# EAGLE design femtoBeacon_r2.0.7_RGB_OTG (EAGLE 7.6.0)

## Sheet 1 of 2
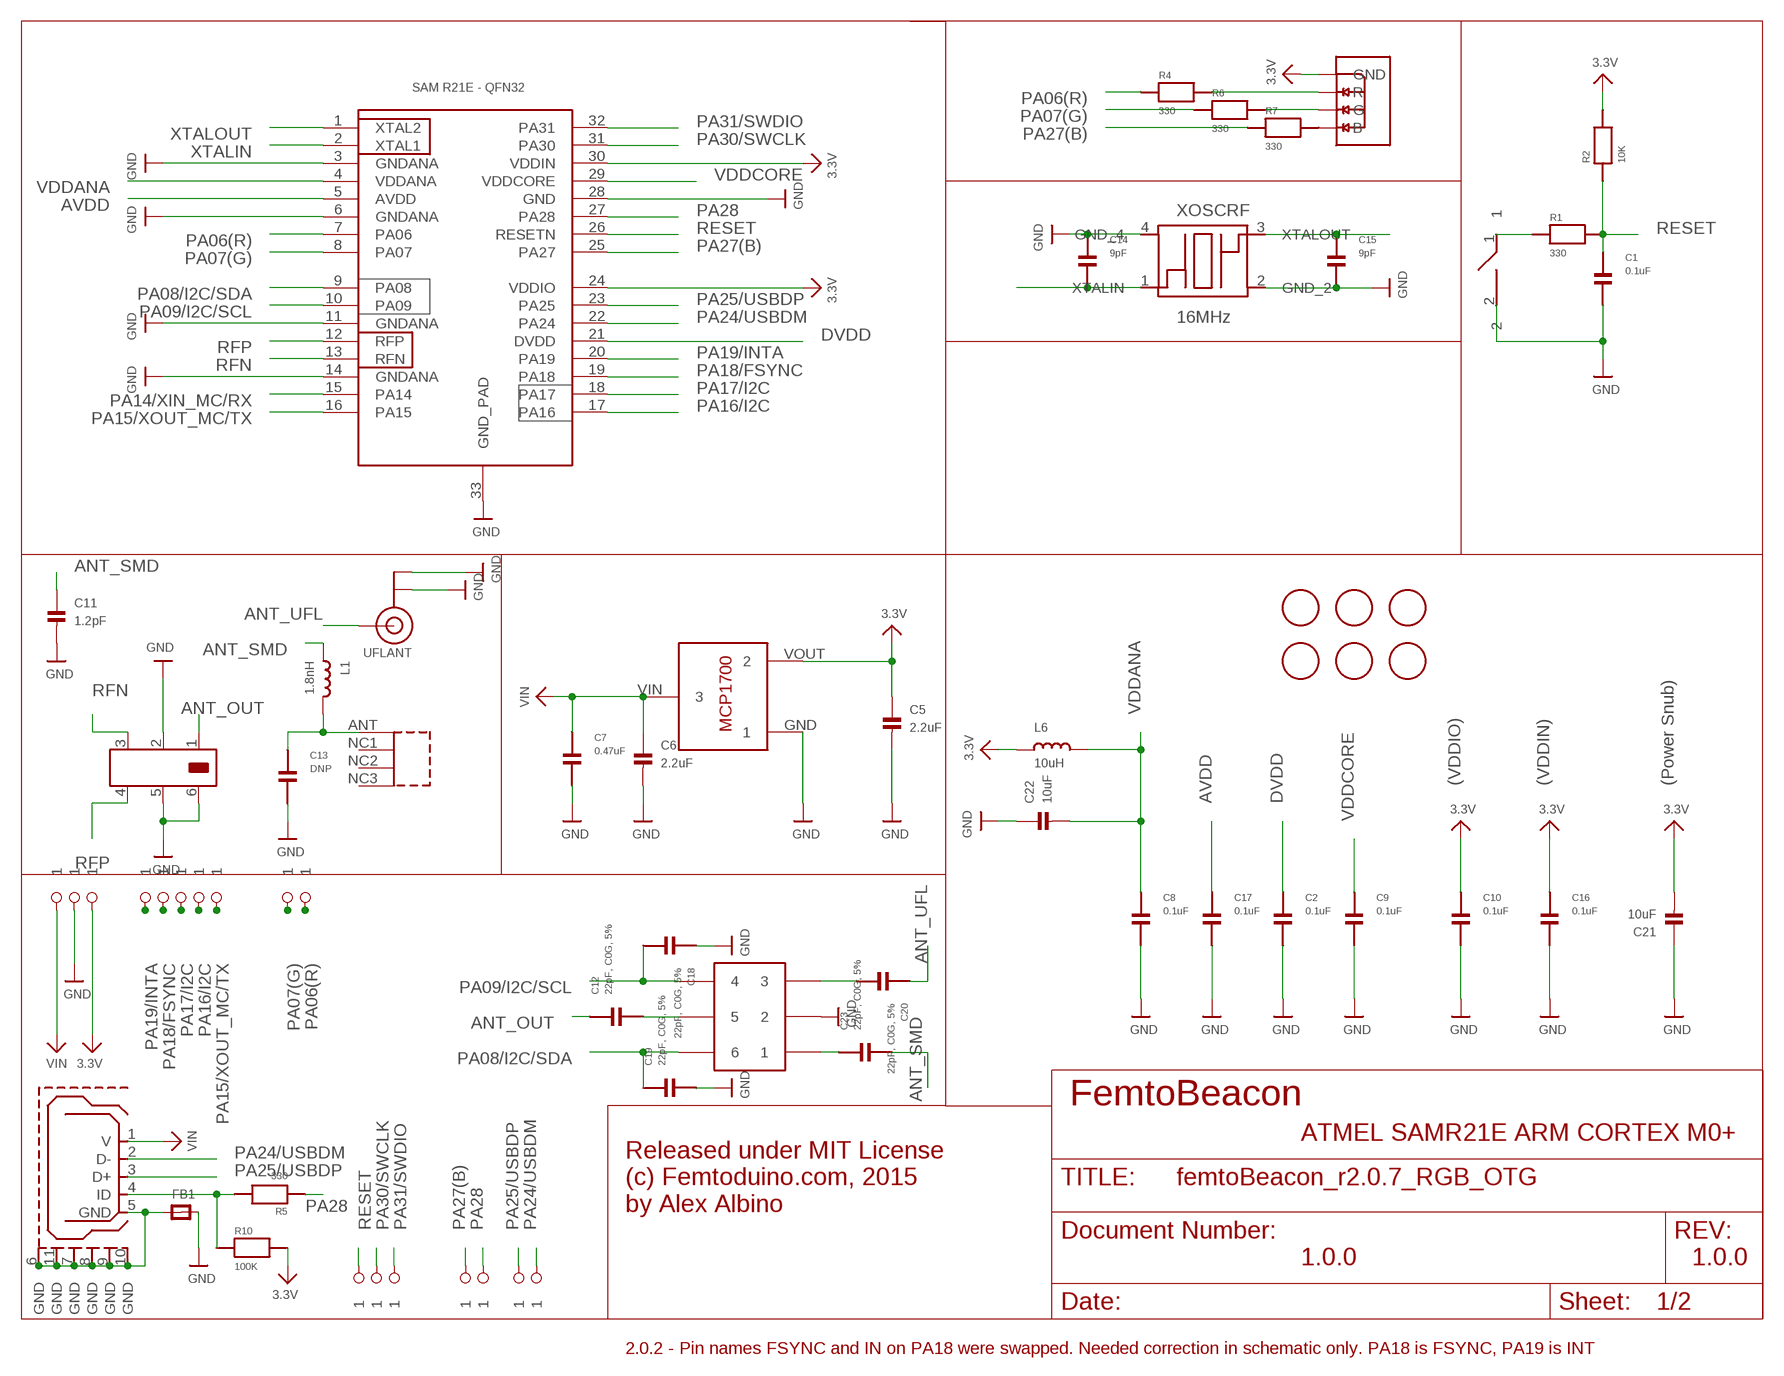
[diagram p0: schematic, sheet 1]

### Parts
ANT_SMD  0479480001  [0479480001]
ASWITCH  AS222-92LF  [AS222-92LF]
BALUN  JOHANSON_2450BM15A0015E  [0805_BALUN]
BTN  DNP  SPST_SMD  [SPST_SMD]
C1  0.1uF  CAPACITOR_0201  [PART]
C2  0.1uF  CAPACITOR_0201  [PART]
C5  2.2uF  CAP_CERAMIC_0402MP  [_0402MP]
C6  2.2uF  CAP_CERAMIC_0402MP  [_0402MP]
C7  0.47uF  CAPACITOR_0201  [PART]
C8  0.1uF  CAPACITOR_0201  [PART]
C9  0.1uF  CAPACITOR_0201  [PART]
C10  0.1uF  CAPACITOR_0201  [PART]
C11  1.2pF  CAP_CERAMIC_0402MP  [_0402MP]
C12  22pF, C0G, 5%  CAPACITOR_0201  [PART]
C13  DNP  CAPACITOR_0201  [PART]
C14  9pF  CAPACITOR_0201  [PART]
C15  9pF  CAPACITOR_0201  [PART]
C16  0.1uF  CAPACITOR_0201  [PART]
C17  0.1uF  CAPACITOR_0201  [PART]
C18  22pF, C0G, 5%  CAPACITOR_0201  [PART]
C19  22pF, C0G, 5%  CAPACITOR_0201  [PART]
C20  22pF, C0G, 5%  CAPACITOR_0201  [PART]
C21  10uF  CAP_CERAMIC_0402MP  [_0402MP]
C22  10uF  CAP_CERAMIC_0402MP  [_0402MP]
C23  22pF, C0G, 5%  CAPACITOR_0201  [PART]
FB1  FERRITE_0603MP  [_0603MP]
FID1  FIDUCIAL  [FIDUCIAL_1MM]
FID2  FIDUCIAL  [FIDUCIAL_1MM]
FID3  FIDUCIAL  [FIDUCIAL_1MM]
FID4  FIDUCIAL  [FIDUCIAL_1MM]
FID5  FIDUCIAL  [FIDUCIAL_1MM]
FID6  FIDUCIAL  [FIDUCIAL_1MM]
IC  ATSAMR21E18A-MUT  [QFN32]
L1  1.8nH  INDUCTOR_0603MP  [_0603MP]
L6  10uH  INDUCTOR_0603MP  [_0603MP]
LDO_VREG  MCP1700T-3302E/TT  [MCP1700T-3302E/TT]
R1  330  RESISTOR_0201  [PART]
R2  10K  RESISTOR_0201  [PART]
R4  330  RESISTOR_0201  [PART]
R5  330  RESISTOR_0201  [PART]
R6  330  RESISTOR_0201  [PART]
R7  330  RESISTOR_0201  [PART]
R10  100K  RESISTOR_0201  [PART]
RGBLED  LRTB_R48G  [LRTB_R48G]
U$1  1X1_ROUND  [1X1_ROUND]
U$2  1X1_ROUND  [1X1_ROUND]
U$5  1X1_ROUND  [1X1_ROUND]
U$7  1X1_ROUND  [1X1_ROUND]
U$9  1X1_ROUND  [1X1_ROUND]
U$10  1X1_ROUND  [1X1_ROUND]
U$35  1X1_ROUND  [1X1_ROUND]
U$36  1X1_ROUND  [1X1_ROUND]
U$37  1X1_ROUND  [1X1_ROUND]
U$38  1X1_ROUND  [1X1_ROUND]
U$39  1X1_ROUND  [1X1_ROUND]
U$43  1X1_ROUND  [1X1_ROUND]
U$45  1X1_ROUND  [1X1_ROUND]
U$46  1X1_ROUND  [1X1_ROUND]
U$47  1X1_ROUND  [1X1_ROUND]
U$48  1X1_ROUND  [1X1_ROUND]
U$54  1X1_ROUND  [1X1_ROUND]
UFLANT  ANTENNA_U.FL  [U.FL]
USB  USB_MICROB  [USB_MICROB_PACKAGE]
XOSCRF  16MHz  TSX-3225  [TSX-3225]

### Nets
3.3V: C5.1 C10.1 C16.1 C21.2 IC.24(VDDIO) IC.30(VDDIN) L6.1 LDO_VREG.VOUT R2.2 R10.2 RGBLED.1(GND) U$5.P$1 ; also sheet 2
ANT_LINE: ANT_SMD.ANT C13.1 L1.2
ANT_OUT: BALUN.1 C12.1
ANT_SMD: C11.1 C23.2 L1.1
ANT_UFL: C20.1 UFLANT.3(SIGNAL)
AVDD: C17.1 IC.5(AVDD)
DVDD: C2.1 IC.21(DVDD)
GND: ASWITCH.PIN2 BALUN.2 BALUN.5 BALUN.6 BTN.2 C1.2 C2.2 C5.2 C6.2 C7.2 C8.2 C9.2 C10.2 C11.2 C13.2 C14.1 C15.2 C16.2 C17.2 C18.1 C19.2 C21.1 C22.1 FB1.2 IC.3(GNDANA) IC.6(GNDANA) IC.11(GNDANA) IC.14(GNDANA) IC.28(GND) IC.33(GND_PAD) LDO_VREG.GND U$2.P$1 UFLANT.1(GND) UFLANT.2(GND) XOSCRF.2(GND_2) XOSCRF.4(GND_4) ; also sheet 2
N$1: R5.2 R10.1 USB.4(ID)
N$5: FB1.1 USB.5(GND) USB.6(GND) USB.7(GND) USB.8(GND) USB.9(GND) USB.10(GND) USB.11(GND)
N$8: R6.2 RGBLED.3(G)
N$9: R7.2 RGBLED.4(B)
N$13: R4.2 RGBLED.2(R)
N$26: BTN.1 R1.1
PA06(R): IC.7(PA06) R4.1 U$54.P$1
PA07(G): IC.8(PA07) R6.1 U$43.P$1
PA08/I2C/SDA: ASWITCH.PIN6 C19.1 IC.9(PA08)
PA09/I2C/SCL: ASWITCH.PIN4 C18.2 IC.10(PA09)
PA14/XIN_MC/RX: IC.15(PA14)
PA15/XOUT_MC/TX: IC.16(PA15) U$39.P$1
PA16/I2C: IC.17(PA16) U$38.P$1 ; also sheet 2
PA17/I2C: IC.18(PA17) U$37.P$1 ; also sheet 2
PA18/FSYNC: IC.19(PA18) U$36.P$1 ; also sheet 2
PA19/INTA: IC.20(PA19) U$35.P$1 ; also sheet 2
PA24/USBDM: IC.22(PA24) U$9.P$1 USB.2(D-)
PA25/USBDP: IC.23(PA25) U$10.P$1 USB.3(D+)
PA27(B): IC.25(PA27) R7.1 U$7.P$1
PA28: IC.27(PA28) R5.1 U$48.P$1
PA30/SWCLK: IC.31(PA30) U$46.P$1
PA31/SWDIO: IC.32(PA31) U$47.P$1
RESET: C1.1 IC.26(RESETN) R1.2 R2.1 U$45.P$1
RFN: BALUN.3 IC.13(RFN)
RFP: BALUN.4 IC.12(RFP)
RFSWITCH_PIN1: ASWITCH.PIN1 C23.1
RFSWITCH_PIN3: ASWITCH.PIN3 C20.2
RFSWITCH_PIN5: ASWITCH.PIN5 C12.2
VDDANA: C8.1 C22.2 IC.4(VDDANA) L6.2
VDDCORE: C9.1 IC.29(VDDCORE)
VIN: C6.1 C7.1 LDO_VREG.VIN U$1.P$1 USB.1(V)
XTALIN: C14.2 IC.2(XTAL1) XOSCRF.1(XTALIN)
XTALOUT: C15.1 IC.1(XTAL2) XOSCRF.3(XTALOUT)
Unconnected: ANT_SMD.NC1 ANT_SMD.NC2 ANT_SMD.NC3

### Notes on the sheet
- (VDDIO) | (VDDIN) | (Power Snub)
- FemtoBeacon
- ATMEL SAMR21E ARM CORTEX M0+
- Released under MIT License
  (c) Femtoduino.com, 2015
  by Alex Albino
- 1.0.0 | 1.0.0
- 2.0.2 - Pin names FSYNC and IN on PA18 were swapped. Needed correction in schematic only. PA18 is FSYNC, PA19 is INT

## Sheet 2 of 2
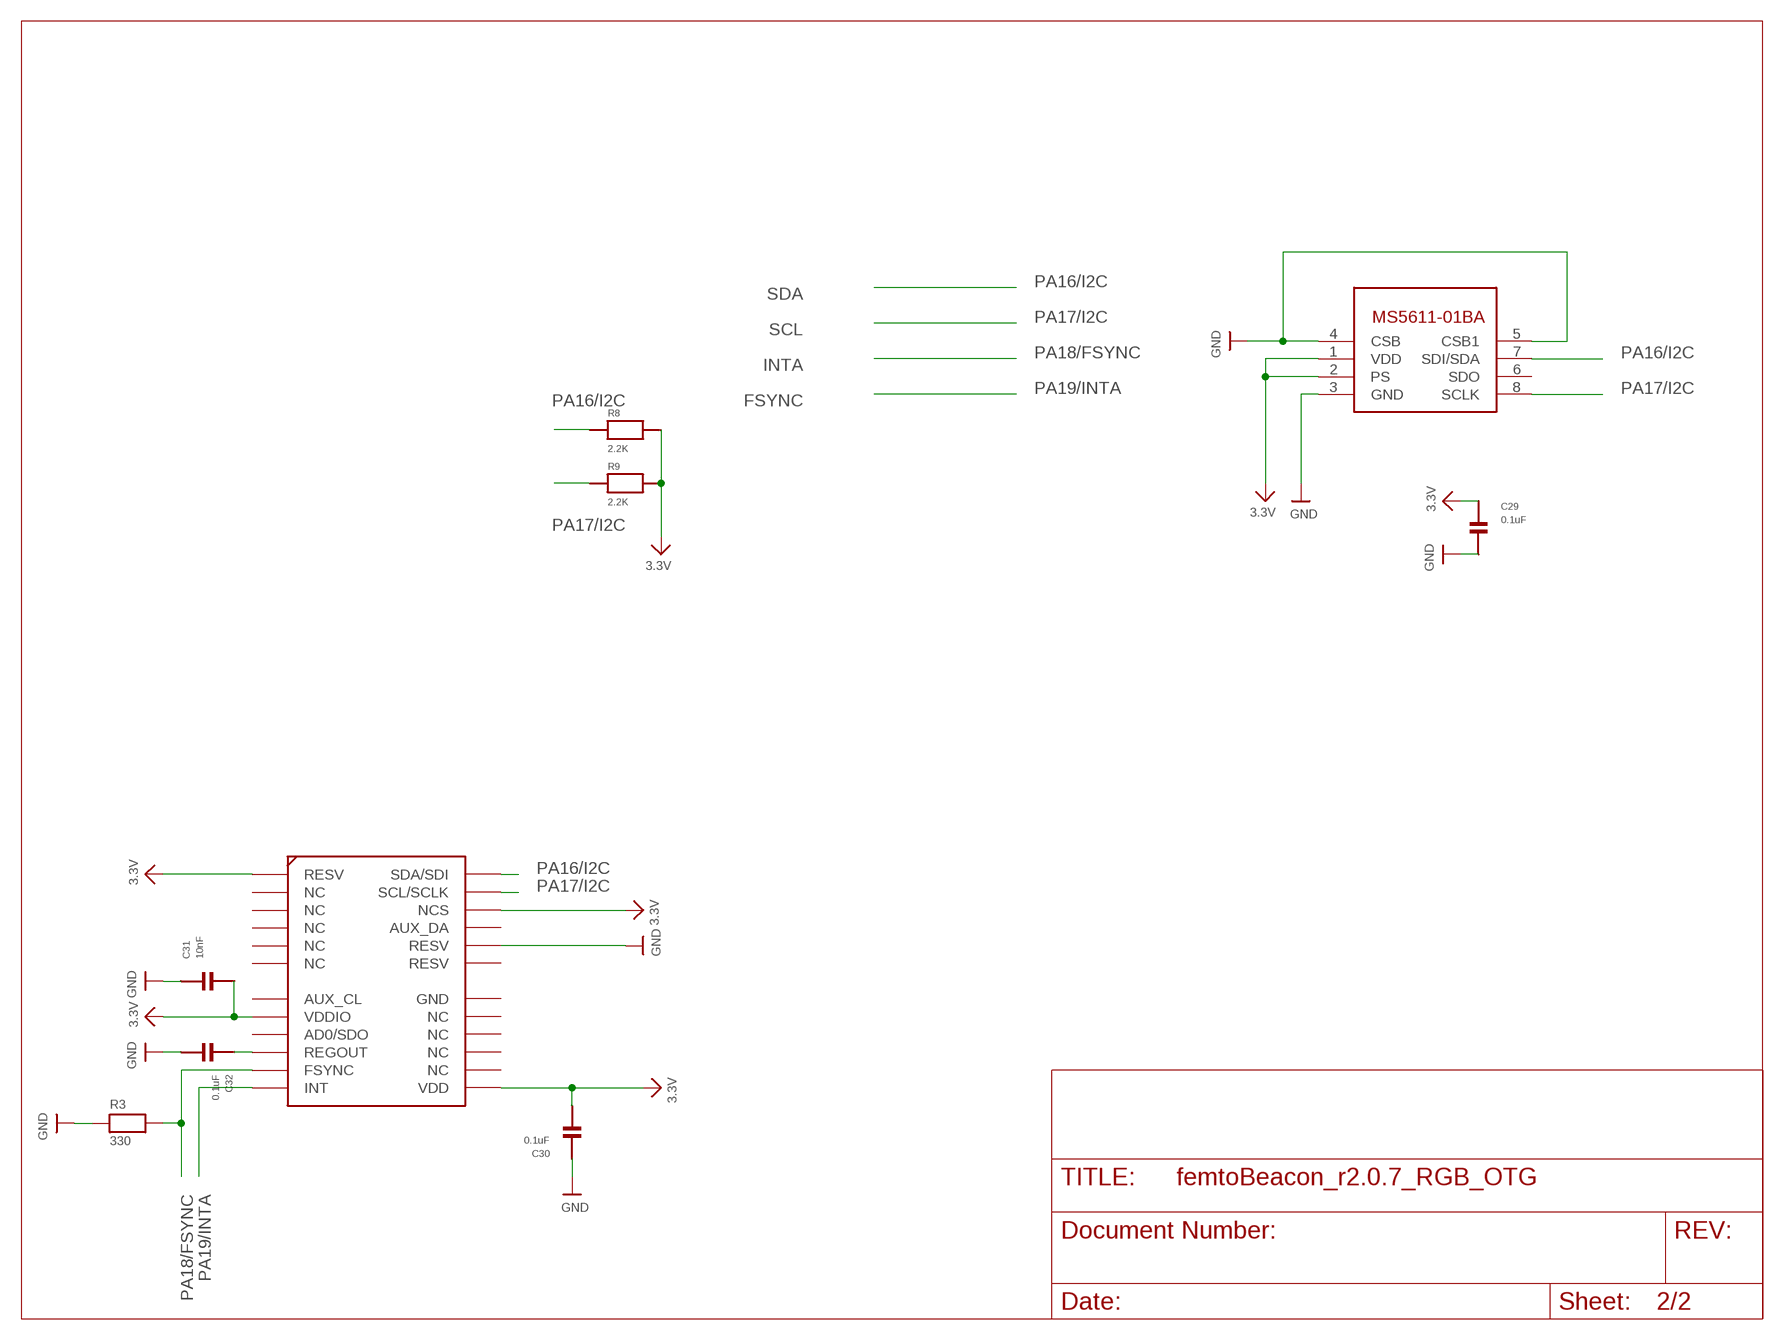
[diagram p1: schematic, sheet 2]

### Parts
BARO  MS5611-01BA03  [MS5611-01BA03]
C29  0.1uF  CAPACITOR_0201  [PART]
C30  0.1uF  CAPACITOR_0201  [PART]
C31  10nF  CAPACITOR_0201  [PART]
C32  0.1uF  CAPACITOR_0201  [PART]
IMU  MPU-9250  [QFN_3X3MM]
R3  330  RESISTOR_0402  [_0402]
R8  2.2K  RESISTOR_0201  [PART]
R9  2.2K  RESISTOR_0201  [PART]

### Nets
3.3V: BARO.1(VDD) BARO.2(PS) C29.1 C30.2 C31.2 IMU.P$1(RESV) IMU.P$8(VDDIO) IMU.P$13(VDD) IMU.P$22(NCS) R8.2 R9.2 ; also sheet 1
GND: BARO.3(GND) BARO.4(CSB) BARO.5(CSB1) C29.2 C30.1 C31.1 C32.2 IMU.P$20(RESV) R3.1 ; also sheet 1
N$4: C32.1 IMU.P$10(REGOUT)
PA16/I2C: BARO.7(SDI/SDA) IMU.P$24(SDA/SDI) R8.1 ; also sheet 1
PA17/I2C: BARO.8(SCLK) IMU.P$23(SCL/SCLK) R9.1 ; also sheet 1
PA18/FSYNC: IMU.P$11(FSYNC) R3.2 ; also sheet 1
PA19/INTA: IMU.P$12(INT) ; also sheet 1
Unconnected: BARO.6(SDO) IMU.P$2(NC) IMU.P$3(NC) IMU.P$4(NC) IMU.P$5(NC) IMU.P$6(NC) IMU.P$7(AUX_CL) IMU.P$9(AD0/SDO) IMU.P$14(NC) IMU.P$15(NC) IMU.P$16(NC) IMU.P$17(NC) IMU.P$18(GND) IMU.P$19(RESV) IMU.P$21(AUX_DA)

### Notes on the sheet
- SDA
- SCL
- INTA
- FSYNC

## Library data of the parts
ANT_SMD = molex-antenna-2.4GHz:0479480001
ASWITCH = skyworks_solutions:AS222-92LF
BALUN = balun:JOHANSON_2450BM15A0015E
BARO = freeimu:MS5611-01BA03
BTN = femtoduino:SPST_SMD
C1 C8-C10 C12-C20 C23 C29-C32 = parts_0201:CAPACITOR_0201; DIGIKEY_PART: 490-3194-1-ND
C2 C7 = parts_0201:CAPACITOR_0201
C5 C6 C11 C21 C22 = microbuilder:CAP_CERAMIC: Ceramic Capacitors 0402 - 0402 Surface Mount Capacitors 16pF 50V 5% [Digikey: 445-4899-2-ND] 18pF 50V 5% [Digikey: 490-1281-2-ND] 22pF 50V 5% [Digikey: 490-1283-2-ND] 68pF 50V 5% [Digikey: 490-1289-2-ND] 0.1uF 10V 10% [Digikey: 490-1318-2-ND] 1.0uF 6.3V 10% [Digikey: 490-1320-2-ND] 0603 - 0603 Surface Mount Capacitors 16 pF 50V 5% [Digikey: 445-5051-2-ND] 22 pF 50V [Digikey: PCC220ACVTR-ND] 33 pF 50V 5% [Digikey: 490-1415-1-ND] 56pF 50V 5% [Digikey: 490-1421-1-ND] 220pF 50V 5% [Digikey: 445-1285-1-ND] 680 pF 50V 2200 pF 50V 5% C0G [Digikey: 445-1297-1-ND] 5600 pF 100V 5% X7R [Digikey: 478-3711-1-ND] 0.1 µF 25V 10% [Digikey: PCC2277TR-ND] 0.22 µF 16V 10% X7R [Digikey: 445-1318-1-ND] 1.0 µF 25V 10% [Digikey: 445-5146-2-ND] 0603 - RF Specific 3pF 250V +/-0.1pF RF [Digikey: 712-1347-1-ND] 18 pF 250V 5% [Digikey: 478-3505-1-ND or 712-1322-1-ND] 56 pF 250V 5% C0G RF [Digikey: 490-4867-1-ND] 68 pF 250V RF [Digikey: 490-4868-1-ND] 0805 - 0805 Surface Mount Capacitors 220 pF 250V 2% RF Ceramic Capacitor [Digikey: 712-1398-1-ND] 1000 pF 50V 2% NP0 Ceramic Capacitor [Digikey: 478-3760-1-ND] 0.1 µF 25V 10% Ceramic Capacitor [Digikey: PCC1828TR-ND] 1.0 µF 16V 10% Ceramic Capacitor[Digikey: 490-1691-2-ND] 10.0 µF 10V 10% Ceramic Capacitor[Digikey: 709-1228-1-ND] 10.0 uF 16V 10% Ceramic Capacitor [Digikey: 478-5165-2-ND] 47 uF 6.3V 20% Ceramic Capacitor [Digikey: 587-1779-1-ND or 399-5506-1-ND] 1206 - 1206 Surface Mount Capacitors 47uF 10V 20% Ceramic Capacitor [Digikey: 490-5528-1-ND or 399-5508-1-ND or 445-6010-1-ND] 100uF 6.3V -20%, +80% Y5V Ceramic Capacitor (Digikey: 490-4512-1-ND, Mouser: 81-GRM31CF50J107ZE1L)
FB1 = microbuilder:FERRITE: Ferrite Bead 0603 MMZ1608B121C - 120 Ohm @ 100MHz, 600mA, 0.15 Ohm DC Resistance - Digikey: 445-2164-1-ND BK1608HW121-T - 120 Ohm, 600mA Ferrite Chip - Digikey: 587-1876-2-ND 0805 HZ0805B272R-10 - 2.7K Ohm @ 100MHz, 200mA, 0.8 Ohm DC Resistance - Digikey: 240-2504-1-ND (see also Murata BLM21BD272SN1L) MMZ2012Y152B - 1.5K Ohm @ 100MHz, 500mA, 0.4 Ohm DC Resistance - Digikey: 445-1560-1-ND - Mainly for high frequency (80-400MHz) MMZ2012R102A - 1K Ohm @ 100MHz, 500mA, 0.3 Ohm DC Resistance - Digikey: 445-1555-2-ND - More general purpose (10-200MHz)
FID1-FID6 = adafruit:FIDUCIAL: For use by pick and place machines to calibrate the vision/machine, 1mm By microbuilder.eu
IC = atmel-samr21:ATSAMR21E18A-MUT: This is the ATMEL SAMR21E QFN-32. ATSAMR21E18A
IMU = mpu9250:MPU-9250
L1 = microbuilder:INDUCTOR: Inductors 0603: 10nH Ceramic Inductor - microwire antenna/RF (Digikey: 712-1434-2-ND) 0805: 560nH Ceramic Inductor - RF (Digikey: 553-1047-1-ND) 270nH Ceramic Inductor - Q = 40@250MHz, +-5%, 1 Ohm DC Resistance (Digikey: 535-10506-2-ND) 1007 (2518 Metric) SMT: 10µH 10% 250mOhm 820mA 1007 Inductor (Digikey: 587-2189-1-ND) 22µH 10% 500mOhm 580mA 1007 Inductor (Digikey: 587-2190-1-ND) 47µH 10% 950mOhm 420mA 1007 Inductor (Digikey: 587-2191-1-ND) 47µH 5% 100mOhm 1A 1008 Inductor (Digikey: 732-1816-1-ND) 5.0x5.0mm (Taiyo Yuden NR5040 Series) 6.8µH 20% 2.3A 64mOhm Inductor (Digikey: 587-2374-2-ND) 5.0x5.0mm (TDK VLC5045 Series) 4.7µH 20% 3.3A 34mOhm Inductor (Digikey: 445-6526-1-ND) 6.8µH 20% 2.7A 46mOhm Inductor (Digikey: 445-6527-1-ND) 6.0x6.0mm (TDK VLC6045 Series) 4.7µH 20% 3.8A 27mOhm Inductor (Digikey: 445-6538-2-ND) 6.8µH 20% 3A 41mOhm Inductor (Digikey: 445-6540-1-ND) 6.2µH 30% 2.2A 45mOhm Inductor (Digikey: SRR5028-6R2YCT-ND) - Not TDK VLC6045 but footprint should match 6.0x6.0mm (TDK SLF6045 Series) 6.8uH 30% 2A 33mOhm Inductor (Digikey: 445-4572-1-ND, Mouser: 810-SLF645T6R8N2R0PF); MFR_ID: L-14C1N8SV4T
L6 = microbuilder:INDUCTOR: Inductors 0603: 10nH Ceramic Inductor - microwire antenna/RF (Digikey: 712-1434-2-ND) 0805: 560nH Ceramic Inductor - RF (Digikey: 553-1047-1-ND) 270nH Ceramic Inductor - Q = 40@250MHz, +-5%, 1 Ohm DC Resistance (Digikey: 535-10506-2-ND) 1007 (2518 Metric) SMT: 10µH 10% 250mOhm 820mA 1007 Inductor (Digikey: 587-2189-1-ND) 22µH 10% 500mOhm 580mA 1007 Inductor (Digikey: 587-2190-1-ND) 47µH 10% 950mOhm 420mA 1007 Inductor (Digikey: 587-2191-1-ND) 47µH 5% 100mOhm 1A 1008 Inductor (Digikey: 732-1816-1-ND) 5.0x5.0mm (Taiyo Yuden NR5040 Series) 6.8µH 20% 2.3A 64mOhm Inductor (Digikey: 587-2374-2-ND) 5.0x5.0mm (TDK VLC5045 Series) 4.7µH 20% 3.3A 34mOhm Inductor (Digikey: 445-6526-1-ND) 6.8µH 20% 2.7A 46mOhm Inductor (Digikey: 445-6527-1-ND) 6.0x6.0mm (TDK VLC6045 Series) 4.7µH 20% 3.8A 27mOhm Inductor (Digikey: 445-6538-2-ND) 6.8µH 20% 3A 41mOhm Inductor (Digikey: 445-6540-1-ND) 6.2µH 30% 2.2A 45mOhm Inductor (Digikey: SRR5028-6R2YCT-ND) - Not TDK VLC6045 but footprint should match 6.0x6.0mm (TDK SLF6045 Series) 6.8uH 30% 2A 33mOhm Inductor (Digikey: 445-4572-1-ND, Mouser: 810-SLF645T6R8N2R0PF)
LDO_VREG = MCP1700T-3302E_TT:MCP1700T-3302E/TT: Microchip LDO "MCP1700" in a 3-Pin SOT-23 package. ID: MCP1700T-3302E/TT
R1 R2 R4-R10 = parts_0201:RESISTOR_0201
R3 = microbuilder:RESISTOR: Resistors 0402 - 0402 Surface Mount Package 22 Ohm 1% 1/16W [Digikey: 311-22.0LRTR-ND] 33 Ohm 5% 1/16W 1.0K 5% 1/16W 1.5K 5% 1/16W 2.0K 1% 1/16W 10.0K 1% 1/16W [Digikey: 311-10.0KLRTR-ND] 10.0K 5% 1/16W [Digikey: RMCF0402JT10K0TR-ND] 12.1K 1% 1/16W [Digikey: 311-22.0LRTR-ND] 100.0K 5% 1/16W 0603 - 0603 Surface Mount Package 0 Ohm 1/10 Watt 1% Resistor 15 Ohm 1/10 Watt 1% Resistor 33 Ohm 1/10 Watt 1% Resistor 49.9 Ohm 1/10 Watt 1% Resistor 100 Ohm 1/10 Watt 1% Resistor 150 Ohm 1/10 Watt 1% Resistor 240 Ohm 1/10 Watt 1% Resistor 390 Ohm 1/10 Watt 1% Resistor 560 Ohm 1/10 Watt 1% Resistor 680 Ohm 1/10 Watt 1% Resistor 750 Ohm 1/10 Watt 1% Resistor 1.0K Ohm 1/10 Watt 1% Resistor 1.5K Ohm 1/10 Watt 1% Resistor 2.0K Ohm 1/10 Watt 1% Resistor 2.2K Ohm 1/10 Watt 1% Resistor 3.3K Ohm 1/10 Watt 1% Resistor 4.7K Ohm 1/10 Watt 1% Resistor 10.0K Ohm 1/10 Watt 1% Resistor 12.0K Ohm 1/10 Watt 1% Resistor 12.1K Ohm 1/10 Watt 1% Resistor 20.0K Ohm 1/10 Watt 1% Resistor 33.0K Ohm 1/10 Watt 1% Resistor 100.0K Ohm 1/10 Watt 1% Resistor 0805 - 0805 Surface Mount Package 0 Ohm 1/8 Watt 1% Resistor 33 Ohm 1/8 Watt 1% Resistor 100 Ohm 1/8 Watt 1% Resistor 150 Ohm 1/8 Watt 1% Resistor 200 Ohm 1/8 Watt 1% Resistor 240 Ohm 1/8 Watt 1% Resistor 330 Ohm 1/8 Watt 1% Resistor 390 Ohm 1/8 Watt 1% Resistor 470 Ohm 1/8 Watt 1% Resistor 1.0K Ohm 1/8 Watt 1% Resistor 1.5K Ohm 1/8 Watt 1% Resistor 2.0K Ohm 1/8 Watt 1% Resistor 4.7K Ohm 1/8 Watt 1% Resistor 5.1K Ohm 1/8 Watt 1% Resistor 5.6K Ohm 1/8 Watt 1% Resistor 10.0K Ohm 1/8 Watt 1% Resistor 22.0K Ohm 1/8 Watt 1% Resistor 33.0K Ohm 1/8 Watt 1% Resistor 100K Ohm 1/8 Watt 1% Resistor 1206 - 1206 Surface Mount Package 2012 - 2010 Surface Mount Package 0.11 Ohm 1/2 Watt 1% Resistor - Digikey: RHM.11UCT-ND
RGBLED = osram_opto_LED:LRTB_R48G; MFR_ID: LRTB R48G
U$1 U$2 U$5 U$7 U$9 U$10 U$35-U$39 U$43 U$45-U$48 U$54 = pins_1.27mm_pitch:1X1_ROUND
UFLANT = adafruit:ANTENNA_U.FL: U.FL Antenna Connector
USB = femtoduino:USB_MICROB: This is the hirose ZX62-B-5PA(11) MICRO-USB B Type female connection.
XOSCRF = crystals:TSX-3225

## Board
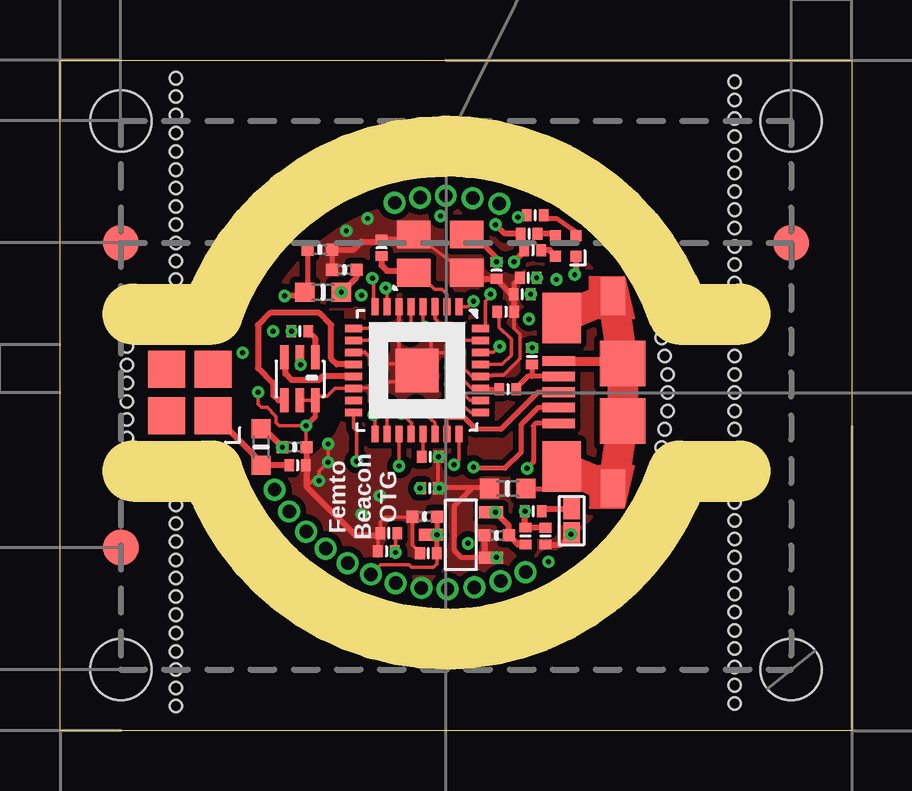
[diagram p2: board, top side]
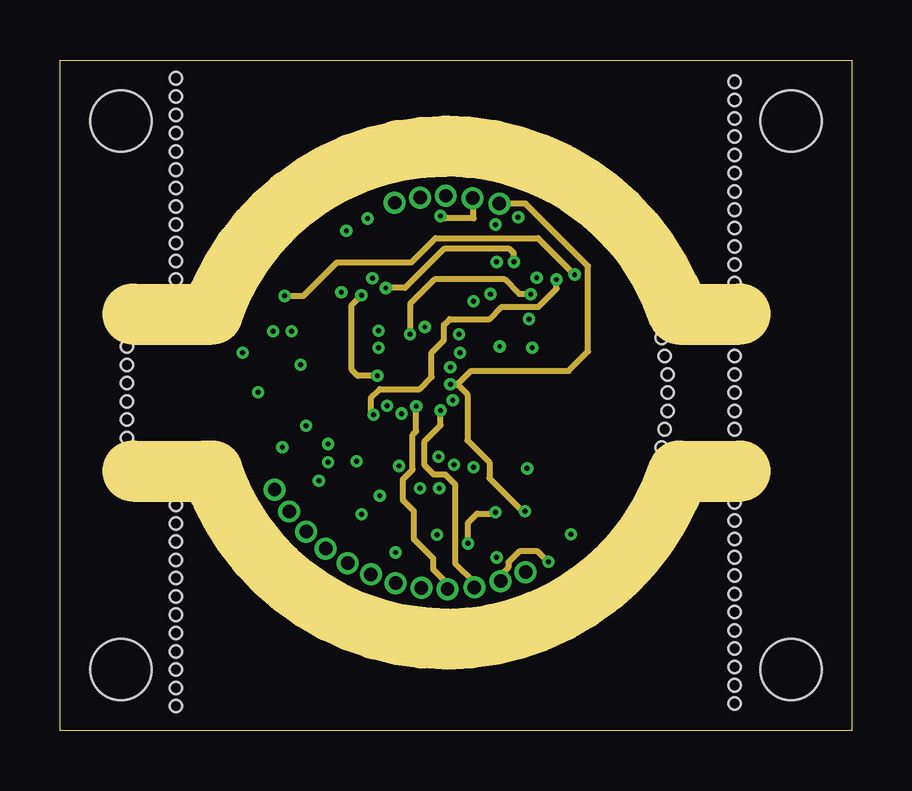
[diagram p3: board, inner layer Route2]
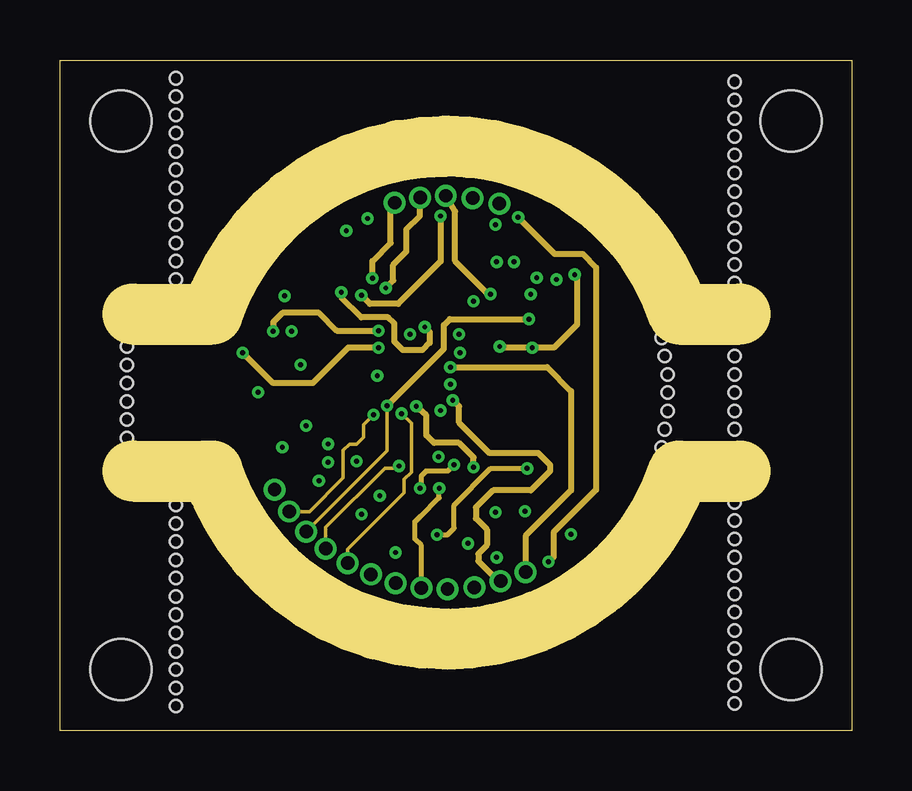
[diagram p4: board, inner layer Route15]
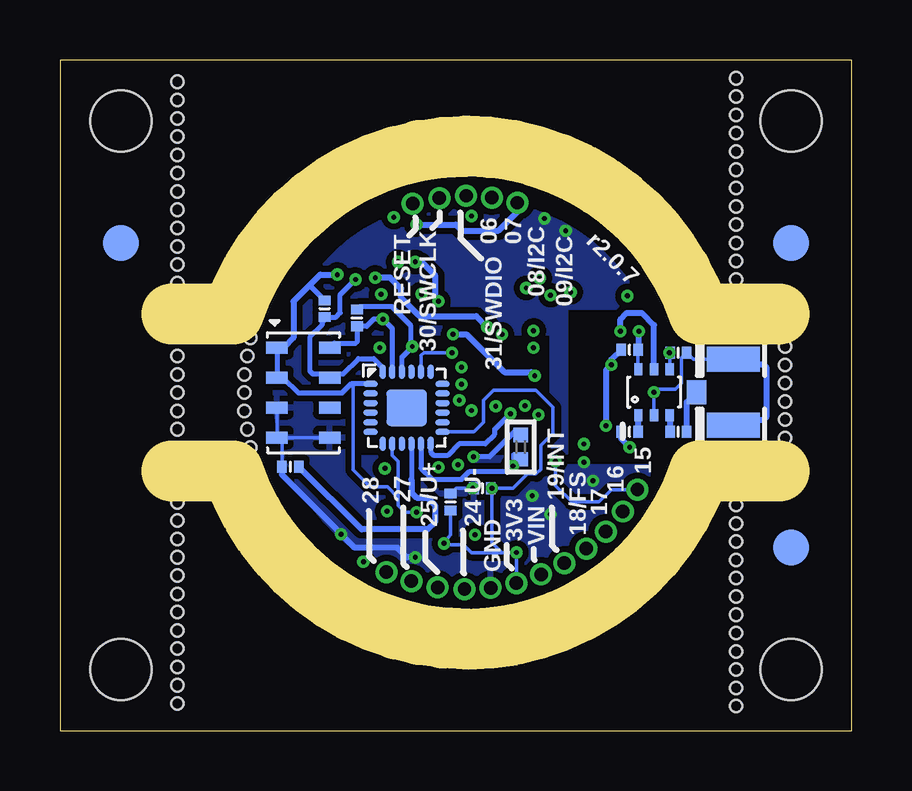
[diagram p5: board, bottom side, seen from below]

Size 33.02 x 27.94 mm. Coordinates in mm from the lower left corner, seen from the top.
Outline: 0,0 0,14.08 0,27.94 33.02,27.94 33.02,0 0,0
Copper layers (1+2*15+16): Top 0.035mm / dielectric 0.7mm / Route2 0.035mm / dielectric 0.15mm / Route15 0.035mm / dielectric 0.2mm / Bottom 0.035mm
Design rules "AQS_custom_4layer": minimum track width 5mil, minimum drill 5mil, track to track 6mil, track to pad 6mil, pad to pad 6mil, via to via 6mil, smd to smd 1mil, copper to edge 15mil, drill to drill 6mil, minimum pad ring 7mil, minimum via ring 3mil, stop-mask expansion 2mil, vias tented up to drill 10mil, thermal gap 10mil
Holes 0.51 mm at 2.79,16 2.79,12.19 2.79,12.95 2.79,13.72 2.79,14.48 2.79,15.24 25.33,14.08 25.08,16.37 25.33,14.84 25.33,13.32 25.21,15.6 25.08,11.79 25.21,12.56 4.83,18.8 4.83,9.4 28.13,14.08 4.83,19.56 4.83,20.32 4.83,21.08 4.83,21.84 4.83,22.61 4.83,23.37 4.83,24.13 4.83,24.89 4.83,25.65 4.83,26.42 4.83,27.18 4.83,8.64 4.83,7.87 4.83,7.11 4.83,6.35 4.83,5.59 4.83,4.83 4.83,4.06 4.83,3.3 4.83,2.54 4.83,1.78 4.83,1.02 28.13,14.84 28.13,15.6 28.13,13.32 28.13,12.56 28.13,9.51 28.13,8.75 28.13,7.98 28.13,7.22 28.13,6.46 28.13,5.7 28.13,4.94 28.13,4.17 28.13,3.41 28.13,2.65 28.13,1.89 28.13,1.13 28.13,18.65 28.13,19.41 28.13,20.18 28.13,20.94 28.13,21.7 28.13,22.46 28.13,23.22 28.13,23.99 28.13,24.75 28.13,25.51 28.13,26.27 28.13,27.03
Holes 2.54 mm at 2.54,2.54 2.54,25.4 30.48,25.4 30.48,2.54
Milling: 8 lines

### Footprints (pad centres in the part's own frame; a part is rotated, then mirrored left to right if it is on the bottom)
0479480001 = smd 1.54 x 1.54: ANT -0.963,0.963; NC1 0.978,0.963; NC2 0.978,-0.978; NC3 -0.963,-0.978
AS222-92LF = smd 0.35 x 0.5: PIN1 -0.65,-0.95; PIN2 0,-0.95; PIN3 0.65,-0.95; PIN4 0.65,0.95; PIN5 0,0.95; PIN6 -0.65,0.95
0805_BALUN = smd 1 x 0.35: 1 -0.9,0.65; 2 -0.9,0; 3 -0.9,-0.65; 4 0.9,-0.65; 5 0.9,0; 6 0.9,0.65
MS5611-01BA03 = smd 0.9 x 0.5: 1 -1.1,1.875; 2 -1.1,0.625; 3 -1.1,-0.625; 4 -1.1,-1.875; 5 1.1,-1.875; 6 1.1,-0.625; 7 1.1,0.625; 8 1.1,1.875
SPST_SMD = smd 0.889 x 0.699: 1 -0.508,0; 2 0.508,0
PART = smd 0.4 x 0.5: 1 -0.35,0; 2 0.35,0
_0402MP = smd 0.5 x 0.5: 1 -0.508,0; 2 0.508,0
_0603MP = smd 0.8 x 0.8: 1 -0.762,0; 2 0.762,0
FIDUCIAL_1MM = smd 1.5 x 1.5: 1 0,0
QFN32 = smd 0.7 x 0.3: 1 -2.65,1.75; 2 -2.65,1.25; 3 -2.65,0.75; 4 -2.65,0.25; 5 -2.65,-0.25; 6 -2.65,-0.75; 7 -2.65,-1.25; 8 -2.65,-1.75; 17 2.65,-1.75; 18 2.65,-1.25; 19 2.65,-0.75; 20 2.65,-0.25; 21 2.65,0.25; 22 2.65,0.75; 23 2.65,1.25; 24 2.65,1.75 | smd 0.3 x 0.7: 9 -1.75,-2.65; 10 -1.25,-2.65; 11 -0.75,-2.65; 12 -0.25,-2.65; 13 0.25,-2.65; 14 0.75,-2.65; 15 1.25,-2.65; 16 1.75,-2.65; 25 1.75,2.65; 26 1.25,2.65; 27 0.75,2.65; 28 0.25,2.65; 29 -0.25,2.65; 30 -0.75,2.65; 31 -1.25,2.65; 32 -1.75,2.65 | smd 1.8 x 1.8: 33 0,0
QFN_3X3MM = smd 0.6 x 0.25: P$1 -1.5,1; P$2 -1.5,0.6; P$3 -1.5,0.2; P$4 -1.5,-0.2; P$5 -1.5,-0.6; P$6 -1.5,-1; P$13 1.5,-1; P$14 1.5,-0.6; P$15 1.5,-0.2; P$16 1.5,0.2; P$17 1.5,0.6; P$18 1.5,1 | smd 0.25 x 0.6: P$7 -1,-1.5; P$8 -0.6,-1.5; P$9 -0.2,-1.5; P$10 0.2,-1.5; P$11 0.6,-1.5; P$12 1,-1.5; P$19 1,1.5; P$20 0.6,1.5; P$21 0.2,1.5; P$22 -0.2,1.5; P$23 -0.6,1.5; P$24 -1,1.5 | smd 1.7 x 1.54: P$25 0,0
MCP1700T-3302E/TT = smd 0.5 x 1: GND -0.95,-1.25; VIN 0,1.25; VOUT 0.95,-1.25
_0402 = smd 0.6 x 0.6: 1 -0.508,0; 2 0.508,0
LRTB_R48G = smd 0.45 x 0.45: 1 0.425,0.425; 2 0.425,-0.425; 3 -0.425,-0.425; 4 -0.425,0.425
1X1_ROUND = drill 0.559 pad 0.864: P$1 0,0
U.FL = smd 2.2 x 1.05: 1 0,1.375; 2 0,-1.375 | smd 0.8 x 1: 3 1.525,0
USB_MICROB_PACKAGE = smd 0.4 x 1.35: 1 -1.3,1.47; 2 -0.64,1.47; 3 0,1.47; 4 0.66,1.47; 5 1.3,1.47 | smd 2.1 x 1.6: 6 -3.1,1.35; 11 3.1,1.35 | smd 1.6 x 1: 7 -4,-0.8; 10 4,-0.8 | smd 1.9 x 1.9: 8 -1.2,-1.2; 9 1.2,-1.2
TSX-3225 = smd 1.4 x 1.15: 1 -1.1,-0.8; 2 1.1,-0.8; 3 1.1,0.8; 4 -1.1,0.8

### Placement (x,y rotation side)
ANT_SMD  5.43,14.08 180 top
ASWITCH  8.26,14.1 0 bottom
BALUN  10,14.66 270 top
BARO  22.87,14.09 0 bottom
BTN  21.33,8.74 270 top
C1  20.24,8.1 270 top
C2  15.44,11.4 0 top
C5  18.21,8.13 180 top
C6  15.21,8.91 180 top
C7  15.36,7.39 180 top
C8  19.53,18.87 180 top
C9  18.59,17.45 0 top
C10  13.71,8.23 180 top
C11  9.78,11.81 0 top
C12  22pF  [PART]  10,16.64 180 top
C13  9.91,11.05 0 top
C14  13.4,20.12 270 top
C15  18.21,19.18 270 top
C16  15.41,10.1 0 top
C17  19.27,18.19 180 top
C18  22pF  [PART]  7.24,15.75 180 bottom
C19  22pF  [PART]  9.27,15.88 180 bottom
C20  22pF  [PART]  7.24,12.45 180 bottom
C21  10.84,20.04 180 top
C22  11.86,19.2 0 top
C23  22pF  [PART]  9.27,12.45 180 bottom
C29  16.73,9.53 90 bottom
C30  15.41,10.1 0 bottom
C31  13.61,7.47 0 top
C32  23.41,11 180 bottom
FB1  Ferrite  [_0603MP]  18.66,10.08 180 top
FID1  2.54,7.62 0 top
FID2  2.54,20.32 0 top
FID3  30.48,20.32 0 top
FID4  2.54,7.62 0 bottom
FID5  2.54,20.32 0 bottom
FID6  30.48,20.32 0 bottom
IC  14.89,15 270 top
IMU  18.57,13.45 0 bottom
L1  8.38,11.81 270 top
L6  10.97,18.26 0 top
LDO_VREG  16.72,8.15 90 top
R1  19.73,9.14 180 top
R2  19.4,8.1 270 top
R3  13.81,11.81 270 bottom
R4  19.71,20.02 0 top
R5  18.67,14.22 0 top
R6  19.56,20.7 0 top
R7  19.81,21.46 0 top
R8  21.99,17.58 90 bottom
R9  20.64,17.2 90 bottom
R10  19.68,15.6 90 top
RGBLED  21.08,20.19 270 top
U$1  12.96,6.51 0 top
U$2  15.06,5.95 0 top
U$5  14,6.15 0 top
U$7  18.37,6.23 0 top
U$9  16.16,5.89 0 top
U$10  17.27,5.97 0 top
U$35  11.99,6.98 0 top
U$36  11.08,7.58 0 top
U$37  10.27,8.29 0 top
U$38  9.56,9.13 0 top
U$39  8.95,10.04 0 top
U$43  13.95,21.99 0 top
U$45  18.32,21.96 0 top
U$46  17.2,22.18 0 top
U$47  16.08,22.28 0 top
U$48  19.41,6.6 0 top
U$54  15.02,22.21 0 top
UFLANT  uFL  [U.FL]  4.95,14.1 180 bottom
USB  22.26,14.1 90 top
XOSCRF  15.85,19.88 0 top

### Tracks (layer width: path | path; a pad name or v marks a point on that pad's centre or on a via)
3.3V  (via drill 0.2 pad 0.51)
  Top 0.14: C31.2 13.96,7.4 v13.99,7.42
  Top 0.152: C30.2 15.01,10.2 v15.01,10.1 | IC.24 16.64,11.27 v16.43,11.07 | C10.1 14.09,8.39 13.99,8.29 v13.99,7.42 | LDO_VREG.VOUT 18.14,9.11 v18.15,9.09 | IC.30 18.08,15.75 v18.33,16
  Top 0.203: C21.2 10.33,18.39 | R10.2
  Top 0.254: 10.33,18.39 L6.1 10.1,18.11 v9.37,18.11 | v18.15,9.09 18.71,8.53 C5.1 19.09,7.75 R2.2 | RGBLED.1 21.51,19.05 v21.46,19
  Route2 0.254: v9.37,18.11 10.15,18.11 11.55,19.51 14.65,19.51 15.66,20.52 19.93,20.52 v21.46,19 | v17.01,7.8 17.01,8.66 17.39,9.04 18.1,9.04 v18.15,9.09
  Route15 0.203: v15.01,10.1 15.06,10.15 15.06,10.6 15.28,10.82 16.17,10.82 v16.43,11.07
  Route15 0.254: v21.46,19 21.46,18.95 21.56,18.85 21.56,16.92 20.59,15.95 R10.2 18.38,15.95 v18.33,16
  Bottom 0.14: v13.99,7.42 U$5.P$1 | v15.01,10.1 C30.2
  Bottom 0.152: 14.6,7.42 15.87,7.42 16.2,7.75 16.96,7.75 v17.01,7.8 16.73,8.15 C29.1 | 14.6,7.42 v13.99,7.42 | 14.6,7.42 15.01,7.83 v15.01,10.1 14.13,10.1 13.53,10.69 13.18,10.69 12.97,10.9 12.97,11.89 12.46,12.39 12.46,13.46 13.18,14.17 14.95,14.17 15.36,13.77 15.36,12.85 15.77,12.45 IMU.P$13 | IMU.P$8 19.17,11.48 18.92,11.23 18.92,9.7 | 18.92,9.7 18.92,9.4 18.61,9.09 v18.15,9.09 | 18.92,9.7 19.37,10.16 20.09,10.16 20.8,10.87 20.8,14.39 20.75,14.45
  Bottom 0.203: BARO.1 BARO.2 23.72,14.71 23.08,14.07 21.25,14.07 20.88,14.45 20.75,14.45 IMU.P$1 | R8.2 22.61,18.55 | R9.2 20.52,17.67 19.2,17.67 18.41,16.89 18.41,16.09 v18.33,16 18.77,15.56 IMU.P$22
  Bottom 0.254: BARO.1 23.68,15.96 23.29,16.36 23.29,17.88 22.61,18.55 22.17,19 v21.46,19
  other vias: 19.68,15.95
ANT_LINE
  Top 0.254: C13.1 L1.2 8.13,11.3 8.13,11.43 6.44,13.12 ANT_SMD.ANT
ANT_OUT
  Top 0.254: BALUN.1 10.65,16.34 C12.1
ANT_SMD  (via drill 0.2 pad 0.51)
  Top 0.254: C11.1 8.51,12.57 L1.1
  Bottom 0.254: C11.1 9.62,12.16 C23.2
  other vias: 9.27,11.81
ANT_UFL
  Bottom 0.254: C20.1 6.89,13.69 UFLANT.3
AVDD  (via drill 0.2 pad 0.51)
  Top 0.152: IC.5 14.64,16.55 v14.6,16.51
  Top 0.254: C17.1 v19.63,18.19
  Route2 0.254: v19.63,18.19 19.15,18.19 18.54,18.8 15.62,18.8 14.6,17.77 v14.6,16.51
DVDD
  Top 0.14: IC.21 15.14,11.45 C2.1
GND  (via drill 0.2 pad 0.51)
  Top 0.14: IC.14 12.26,14.28 | 14.14,14.53 14.62,15 IC.33 | v15.81,10.1 C30.1 15.76,11.38 C2.2 | 17.9,10.16 17.85,10.11
  Top 0.152: 12.26,14.28 13.48,14.28 13.73,14.53 14.14,14.53 | IC.14 11.48,14.25 11.14,13.92 10.78,13.92 BALUN.6 BALUN.5 | 13.31,20.37 C14.1 | XOSCRF.4 XOSCRF.2 | C31.1 13.26,8.26 C10.2 13.36,8.69 13.56,8.89 14.68,8.89 C6.2 14.7,7.72 14.73,7.7 C7.2 | IC.11 12.71,15.75 13.18,15.29 14.6,15.29 IC.33 | IC.6 14.14,16.91 14.04,16.82 14.04,16.26 14.14,16.15 14.14,15.75 IC.33 | IC.3 15.64,17.15 15.77,17.02 15.77,16.51 15.46,16.2 15.46,15.58 IC.33 | LDO_VREG.GND 18.2,7.21 v18.2,7.21 | BTN.2 21.33,8.21 v21.3,8.18 | 18.96,17.37 C9.2 18.92,17.44 18.92,16.76 19.18,16.51 19.18,15.49 18.49,14.81 17.57,14.81 IC.28 17.17,14.75 16.78,15.14 16.78,15.65 v16.68,15.75 15.63,15.75 IC.33 | C11.2 10.26,11.84 v10.26,12.7 9.14,12.7 9.02,12.83 9.02,13.08 8.64,13.46 8.38,13.46 8.26,13.59 v8.26,14.1 | BALUN.2 10.13,15.27 v10.03,15.24 | 10.29,10.16 10.54,10.41 v10.79,10.41 10.79,10.79 v11.18,11.18 v11.18,11.94
  Top 0.203: C21.1 C22.1 | 17.85,10.11 17.19,10.11 | 17.19,10.11 15.82,10.11 v15.81,10.1 | 17.9,10.16 FB1.2 | 17.86,7.32 LDO_VREG.GND 16.74,7.21 16.45,7.49 16.45,9.37 17.19,10.11 | C8.2 18.92,18.62 C17.2 | v10.26,12.7 10.65,13.1 BALUN.6
  Top 0.254: C21.1 12.24,20.04 12.57,20.37 13.31,20.37 | C14.1 14.34,20.47 XOSCRF.4 | XOSCRF.2 17.2,18.83 C15.2 18.8,18.19 C17.2 18.94,18.17 C9.2 | C1.2 20.88,7.75 v21.3,8.18 | C5.2 17.7,7.21 LDO_VREG.GND | 10.29,11.08 10.29,10.16 12.32,8.13 13.26,8.13 C10.2 | C11.2 10.29,11.08 | 10.29,11.08 C13.2
  Route15 0.203: U$2.P$1 15.06,7.71 14.8,7.98 14.8,8.71 15.01,8.91 15.03,8.91 15.81,9.7 v15.81,10.1
  Bottom 0.14: C30.1 v15.81,10.1 16.51,10.1 C29.2
  Bottom 0.152: IMU.P$20 17.97,15.63 17.85,15.75 v16.68,15.75 | BARO.5 BARO.4 | BARO.3 BARO.4 | C32.2 23.76,12 BARO.4 | UFLANT.2 6.61,15.47 C18.1 7.11,15.53 7.11,14.48 7.37,14.22 8.13,14.22 v8.26,14.1 ASWITCH.PIN2 | C19.2 9.65,15.75
  Bottom 0.203: C2.2 15.11,11.4 14.06,12.45 R3.1
  Bottom 0.254: v18.2,7.21 18.56,7.21 18.97,7.62 20.75,7.62 v21.3,8.18 21.33,8.21 BTN.2 23.76,10.66 C32.2 | C19.2 10.03,15.46 v10.03,15.24 10.26,15.02 v10.26,12.7 | 4.55,12.72 UFLANT.1 4.72,12.95 3.68,12.95 3.56,13.08 3.56,15.11 3.68,15.24 4.72,15.24 UFLANT.2
  other vias: 15.79,11.4 13.34,9.78 12.57,9.02 11.94,20.83 12.83,21.34
  pour Top (isolate 0.254, no thermals): 9.11,18.41 9.11,17.58 11.91,17.58 11.91,13.28 arc-10 11.5,12.32 arc-10 10.23,11.18 arc-10 8.48,11.05 8.48,10.51 arc60 16.08,6.08 arc90 24.08,14.08 arc90 16.08,22.08 arc60
  pour Bottom (isolate 0.254): 9.11,18.41 9.11,17.58 11.91,17.58 11.91,15.88 12.54,15.88 12.54,16.51 20.54,16.51 20.54,11.43 12.54,11.43 12.54,15.85 11.91,15.85 11.91,11.05 8.48,11.05 8.48,10.51 arc60 16.08,6.08 arc90 24.08,14.08 arc90 16.08,22.08 arc60
N$1
  Top 0.203: USB.4 19.68,14.76 | 19.68,14.76 19.5,14.76 19.09,14.35 R5.2 | R10.1 19.68,14.76
N$4
  Bottom 0.203: 23.04,11.02 C32.1 | IMU.P$10 18.37,10.45
  Bottom 0.254: 18.37,10.45 18.37,9.92 18.15,9.7 17.7,9.7 17.39,9.4 17.39,8.69 17.7,8.38 20.45,8.38 C32.1
N$5
  Top 0.203: FB1.1 20.35,10.08 USB.6 | 23.36,15.4 USB.9
  Top 0.381: USB.5 23.36,15.4 arc-90 USB.9
  Top 0.508: 23.46,17.7 USB.10 | 23.46,10.5 USB.7
  Top 1.27: USB.11 USB.10 USB.9 USB.8 USB.7 USB.6
N$8
  Top 0.254: RGBLED.3 20.49,20.7 R6.2
N$9
  Top 0.203: R7.2 20.29,21.34 20.7,21.34 21.51,20.78 RGBLED.4
N$13
  Top 0.254: RGBLED.2 20.41,20.02 R4.2
N$26
  Top 0.254: R1.1 20.18,9.25 BTN.1
PA06(R)  (via drill 0.2 pad 0.51)
  Top 0.152: v13.58,18.44 13.64,18.39 IC.7
  Top 0.254: R4.1 19.36,19.96 v18.92,19.53
  Route2 0.254: v18.92,19.53 18.92,19.89 18.75,20.07 16,20.07 14.38,18.44 v13.58,18.44
  Route15 0.254: v13.58,18.44 13.89,18.75 13.89,19.41 14.45,19.96 14.45,20.88 15.01,21.44 15.01,22.19 U$54.P$1
PA07(G)  (via drill 0.2 pad 0.51)
  Top 0.152: v13.02,18.85 13.07,18.8 13.07,17.93 13.14,17.77 IC.8
  Top 0.254: R6.1 18.54,20.7 v18.16,21.08
  Route15 0.254: v13.02,18.85 13.02,19.56 13.79,20.32 13.79,21.83 U$43.P$1
  Bottom 0.254: v18.16,21.08 16.51,21.08 16.26,20.83 14.73,20.83 13.95,21.61 U$43.P$1
PA08/I2C/SDA  (via drill 0.2 pad 0.51)
  Top 0.152: IC.9 13.16,16.75 v13.28,16.66
  Route15 0.254: v8.89,16.64 8.89,17.02 9.27,17.4 10.79,17.4 11.53,16.66 v13.28,16.66
  Bottom 0.152: 8.89,15.75 8.9,15.73 C19.1 8.92,15.06 ASWITCH.PIN6
  Bottom 0.254: 8.9,15.73 8.91,15.73 | C19.1 8.89,15.91 v8.89,16.64
PA09/I2C/SCL  (via drill 0.2 pad 0.51)
  Top 0.152: IC.10 12.98,16.25 v13.28,15.95
  Route15 0.254: v13.28,15.95 12.01,15.95 10.54,14.48 8.89,14.48 v7.62,15.75
  Bottom 0.152: v7.62,15.75 7.61,15.73 C18.2 7.59,15.06 ASWITCH.PIN4
PA15/XOUT_MC/TX  (via drill 0.2 pad 0.51)
  Top 0.14: IC.16 12.24,12.62 12.36,12.5 v12.36,11.23 12.39,11.23
  Bottom 0.152: v12.36,11.23 12.36,10.2 11.68,9.53 10.54,9.53 10.03,10.03 U$39.P$1
PA16/I2C  (via drill 0.2 pad 0.51)
  Top 0.14: IC.17 13.14,13.07 v13.07,13.16
  Route2 0.254: v13.08,13.16 v13.07,13.16 12.95,13.28 12.95,13.84 13.34,14.22 14.99,14.22 15.49,14.73 15.49,15.75 16,16.26 16,16.89 16.26,17.14 17.91,17.14 18.41,17.65 19.94,17.65 20.7,18.41 v20.7,18.8
  Route15 0.152: v13.07,13.16 12.66,12.74 12.66,12.23 12.37,11.94 12.06,11.94 11.81,11.68 11.81,10.54 10.4,9.13 U$38.P$1
  Bottom 0.203: IMU.P$24 19.57,15.12 19.94,15.49 20.57,15.49 21.21,14.86 21.62,14.86 BARO.7 21.92,14.86 22.48,14.86 22.61,14.99 22.61,16.38 22.1,16.89 22.1,17.02 21.99,17.13 R8.1 21.51,17.23 21.34,17.4 21.34,18.16 v20.7,18.8
PA17/I2C  (via drill 0.2 pad 0.51)
  Top 0.14: IC.18 13.63,12.4 v13.63,13.54
  Route15 0.152: U$37.P$1 13.63,11.66 v13.63,13.54
  Route15 0.254: v13.63,13.54 16,15.91 16,16.89 16.26,17.14 v19.56,17.14
  Bottom 0.203: 21.59,16.14 BARO.8 21.6,16.13 20.7,16.13 20.64,16.19 R9.1 20.24,16.85 19.94,17.14 v19.56,17.14 19.17,16.76 IMU.P$23
PA18/FSYNC  (via drill 0.2 pad 0.51)
  Top 0.14: IC.19 v14.14,11.02
  Route15 0.152: U$36.P$1 11.08,8.47 13.56,10.92 14.04,10.92 v14.14,11.02
  Bottom 0.152: 14.14,11.51 v14.14,11.02
  Bottom 0.203: IMU.P$11 17.97,10.94 17.49,10.46 16.27,10.46 15.95,10.79 14.37,10.79 v14.14,11.02 13.86,11.3 R3.2
PA19/INTA  (via drill 0.2 pad 0.51)
  Top 0.14: IC.20 14.65,12.44 14.65,12.8 v14.24,13.21
  Route15 0.152: U$35.P$1 11.99,7.56 14.34,9.91 14.34,10.46 14.65,10.77 14.65,12.8 v14.24,13.21
  Bottom 0.203: v14.24,13.21 14.89,12.56 14.89,12.35 15.3,11.95 16.38,11.95 16.84,11.48 17.45,11.48 17.57,11.6 IMU.P$12
PA24/USBDM  (via drill 0.2 pad 0.51)
  Top 0.14: IC.22 15.64,12.83 v14.85,13.51
  Top 0.203: USB.2 19.93,13.46 19.22,12.75 19.22,11.58 18.56,10.92 17.29,10.92 v17.24,10.97
  Route2 0.254: U$9.P$1 16.16,6.11 15.56,6.71 15.56,7.16 14.75,7.98 14.75,9.14 14.29,9.6 14.29,10.46 14.7,10.87 14.7,12.32 14.85,12.47 v14.85,13.51
  Route15 0.254: v17.24,10.97 17.24,11.38 16.63,11.99 15.59,11.99 15.28,12.3 15.28,13.13 v14.85,13.51
PA25/USBDP  (via drill 0.2 pad 0.51)
  Top 0.152: IC.23 16.14,13.07 v15.87,13.34
  Top 0.203: USB.3 19.93,14.1 18.38,12.55 17.34,12.55 16.86,13.03 16.17,13.03 v15.87,13.34
  Route2 0.254: U$10.P$1 17.27,6.16 16.48,6.96 16.48,10.26 16.07,10.67 15.59,10.67 15.21,11.05 15.21,12.06 15.87,12.72 v15.87,13.34
PA27(B)  (via drill 0.2 pad 0.51)
  Top 0.152: IC.25 17.12,13.25 16.93,13.44 16.76,13.44 v16.38,13.77
  Top 0.254: R7.1 19.18,21.46 v19.1,21.39
  Route2 0.254: v20.37,7.04 20.34,7.04 19.91,7.47 19.15,7.47 18.69,7.01 18.69,6.81 18.37,6.48 U$7.P$1
  Route15 0.254: U$7.P$1 18.28,6.23 17.44,7.06 17.44,7.37 17.8,7.72 17.8,8.38 17.34,8.84 17.34,9.3 18.05,10.01 19.63,10.01 20.44,10.82 20.44,11.06 19.94,11.56 17.91,11.56 16.64,12.83 16.64,13.51 v16.38,13.77 | v20.37,7.04 20.57,7.24 20.57,8.26 22.35,10.03 22.35,19.3 21.79,19.86 20.62,19.86 v19.1,21.39
PA28  (via drill 0.2 pad 0.51)
  Top 0.152: IC.27 17.16,14.25 v16.27,15.14
  Top 0.203: IC.27 17.54,14.22 R5.1
  Route15 0.254: v16.27,15.14 20.31,15.14 21.3,14.15 21.3,10.01 19.41,8.12 U$48.P$1
PA30/SWCLK  (via drill 0.2 pad 0.51)
  Top 0.152: IC.31 16.89,16.25 v16.63,16.51
  Route2 0.254: U$46.P$1 17.24,22.14 17.24,21.34 16.02,21.34 v15.87,21.44 | v13.23,14.78 12.41,14.78 12.16,15.04 12.16,17.73 v12.57,18.14
  Route15 0.254: v15.87,21.44 15.87,19.55 14.1,17.78 12.92,17.78 v12.57,18.14
  Bottom 0.254: v16.63,16.51 16.07,16.51 14.5,14.94 13.38,14.94 v13.23,14.78
PA31/SWDIO  (via drill 0.2 pad 0.51)
  Top 0.152: v17.95,18.19 17.95,18.09 17.75,17.88 17.75,16.75 IC.32
  Route15 0.254: v17.95,18.19 17.85,18.19 16.48,19.56 16.48,21.63 U$47.P$1
RESET  (via drill 0.2 pad 0.51)
  Top 0.152: IC.26 17.1,13.75 16.43,14.43 v16.27,14.43
  Top 0.254: R1.2 19.38,8.47 R2.1 C1.1
  Route2 0.254: R1.2 19.27,9.14 17.9,10.52 17.9,11.18 16.99,12.09 16.99,14.02 16.58,14.43 17.14,14.99 21.2,14.99 22.02,15.8 22.02,19.36 19.41,21.96 U$45.P$1
  Route2 0.305: 16.58,14.43 v16.27,14.43
  other vias: 19.38,9.14
RFN
  Top 0.254: IC.13 10.94,14.75 10.79,14.61 9.65,14.61 9.4,14.86 9.4,15.51 BALUN.3
RFP
  Top 0.254: IC.12 11.54,15.25 11.3,15.49 11.3,16.89 10.79,17.4 8.76,17.4 8.26,16.89 8.26,15.11 8.89,14.48 8.89,13.97 9.1,13.76 BALUN.4
RFSWITCH_PIN1
  Bottom 0.152: 8.9,12.46 C23.1
  Bottom 0.254: 8.9,12.46 ASWITCH.PIN1
RFSWITCH_PIN3
  Bottom 0.152: 7.61,12.46 C20.2
  Bottom 0.254: ASWITCH.PIN3 7.59,13.13 C20.2
RFSWITCH_PIN5  (via drill 0.2 pad 0.51)
  Top 0.254: C12.2
  Bottom 0.254: ASWITCH.PIN5 8.26,16.89 8.76,17.4 9.4,17.4 9.65,17.14 C12.2
  other vias: 9.65,16.64
VDDANA  (via drill 0.2 pad 0.51)
  Top 0.152: IC.4 15.14,16.89 v15.21,16.82
  Top 0.254: C22.2 12.36,18.9 L6.2
  Route15 0.254: v15.21,16.82 15.41,16.61 15.41,16.15 15.11,15.85 14.29,15.85 13.94,16.2 13.94,16.97 13.68,17.22 12.57,17.22 11.73,18.06 L6.2
  Bottom 0.254: v15.21,16.82 15.66,17.27 18.03,17.27 18.8,18.03 18.8,18.41 19.25,18.87 C8.1
  other vias: 11.73,18.26 19.88,18.87
VDDCORE
  Top 0.152: IC.29 18.42,15.25 18.82,15.65 18.82,16.31 18.31,16.82 18.31,17.38 C9.1
VIN  (via drill 0.2 pad 0.51)
  Top 0.14: C7.1 15.71,6.95 15.56,6.81 14.65,6.81 14.55,6.91 13.36,6.91 U$1.P$1
  Top 0.203: USB.1 19.83,12.8 19.73,12.7 19.73,11.18 v19.48,10.92 | LDO_VREG.VIN v15.72,8.15 | C6.1 v15.71,8.16 v15.72,8.15 | C7.1 v15.71,8.15 v15.72,8.15
  Route15 0.203: v15.72,8.15 16.15,8.15 16.43,8.43 16.43,9.4 17.95,10.92 v19.48,10.92
XTALIN
  Top 0.152: 14.62,19.15 XOSCRF.1 15.08,18.75 15.26,18.75 15.61,18.39 15.92,18.39 16.14,18.17 IC.2
  Top 0.254: C14.2 13.4,19.38 13.63,19.15 14.62,19.15
XTALOUT  (via drill 0.2 pad 0.51)
  Top 0.152: XOSCRF.3 16.9,20.78 | IC.1 17.01,17.65 v17.24,17.88
  Top 0.203: 16.9,20.78 17.14,20.78 18.2,19.71 C15.1
  Bottom 0.254: v17.24,17.88 17.37,18.02 17.37,18.95 17.95,19.53 C15.1
  other vias: 18.21,19.53

### Text on the board
tPlace: Femto / Beacon / OTG
bPlace: 09/I2C | 08/I2C | 07 | 06 | 30/SWCLK | RESET | r2.0.7 | 31/SWDIO | 15 | 16 | 19/INT | 17 | 27 | 28 | 18/FS | VIN | 3V3 | 24 U- | 25/U+ | GND
tDocu: 2.54mm diameter Milling